# Altium schematic sheet config-top.SchDoc: Config FPGA - Top
size Legal; CheckedBy: J. Brinton; CompanyName: Signal Laboratories, Inc.; DrawnBy: J. Brinton; Engineer: J. Brinton; Address1: 3479 Edison Way; Address2: Menlo Park CA 94025; Address3: +1 (877) 778-8435; Address4: siglabs.com; DocumentNumber: 11; Revision: 2b; SheetNumber: 12; SheetTotal: 58
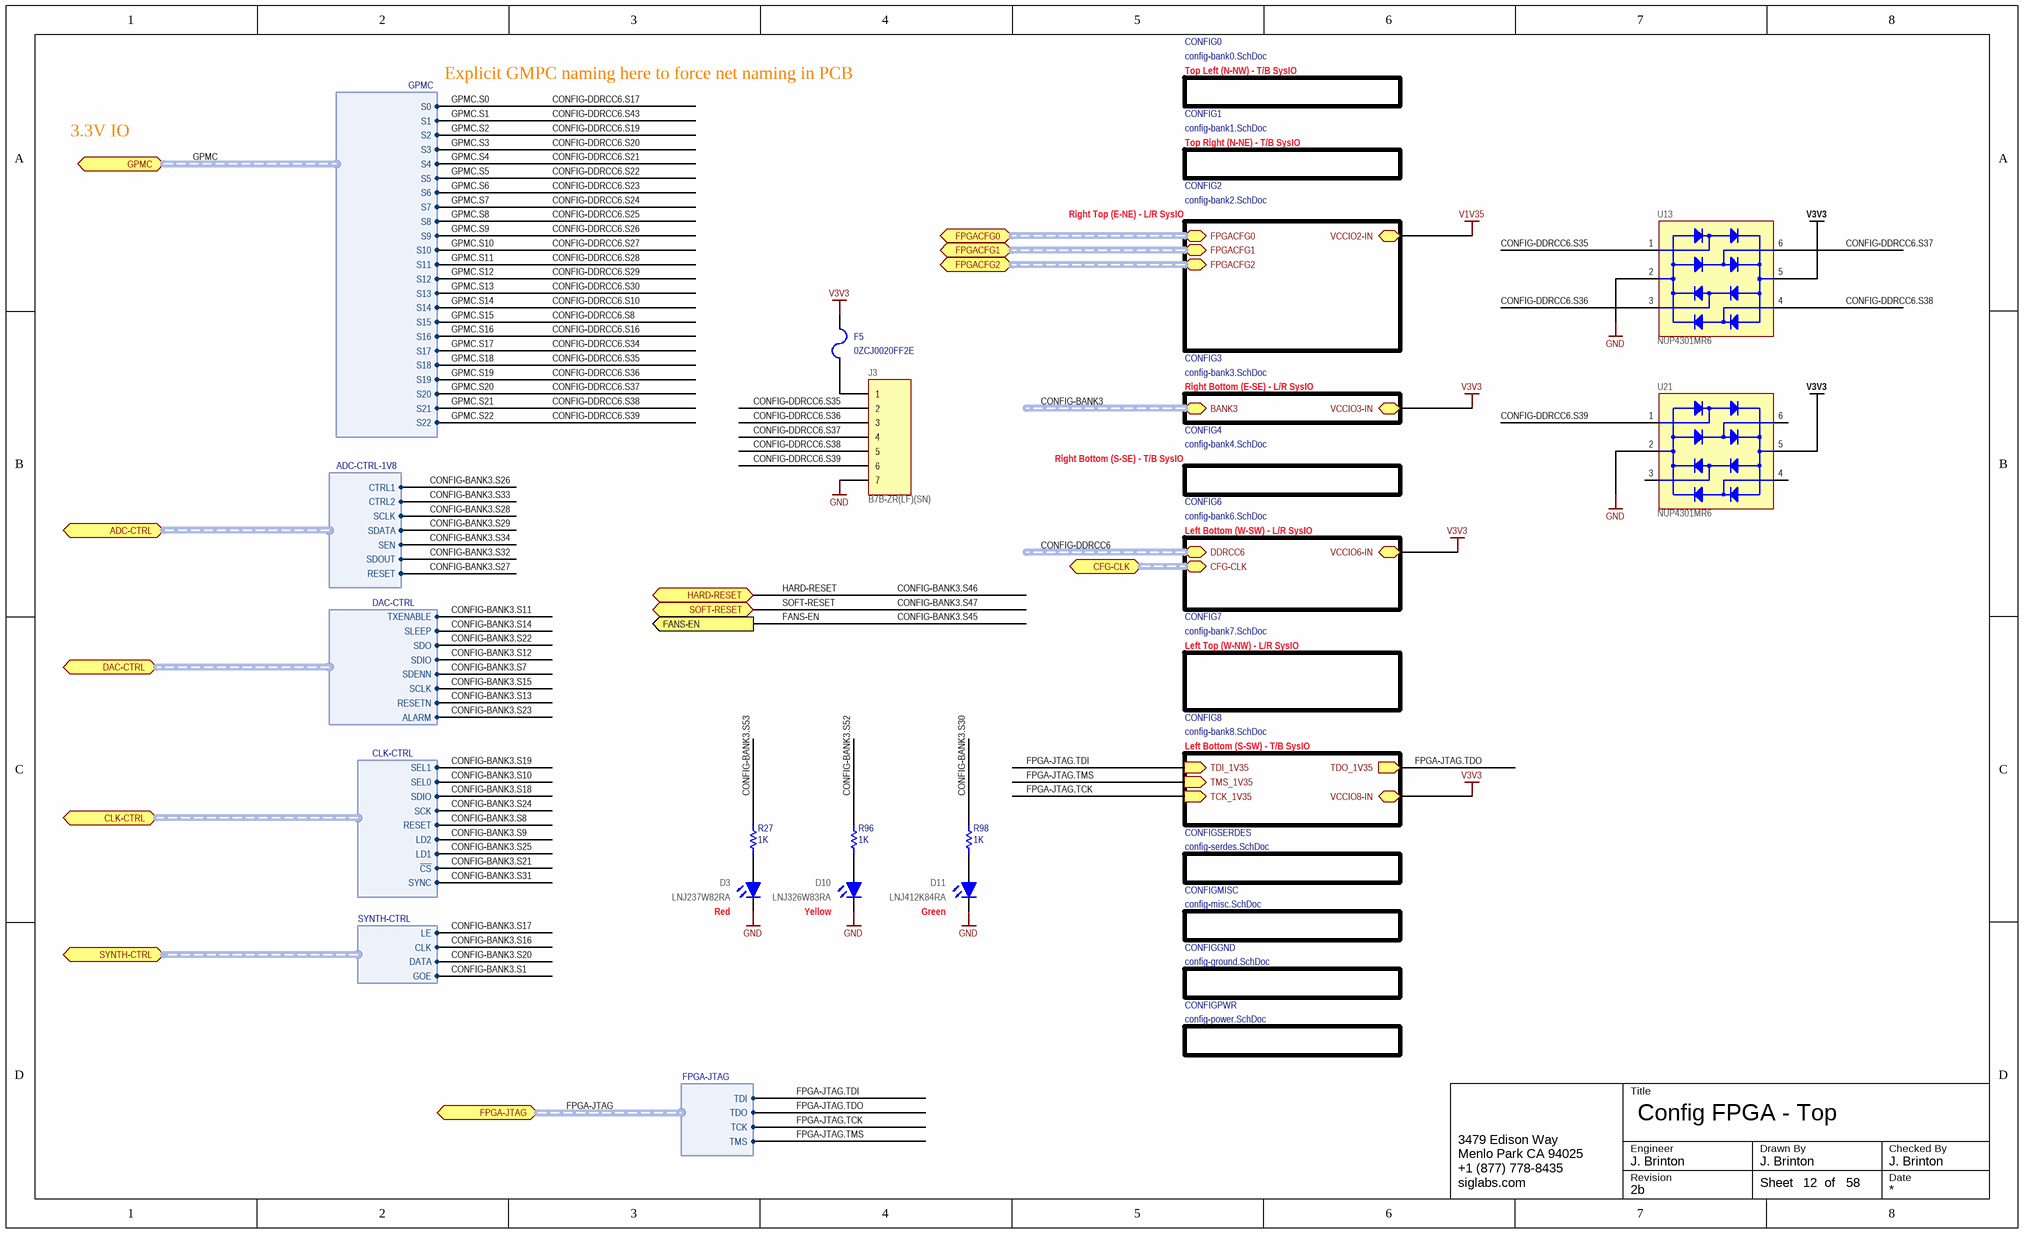
[diagram p0: config-top.SchDoc]

## Parts
D3  LNJ237W82RA  [0603_LED]
D10  LNJ326W83RA  [0603_LED]
D11  LNJ412K84RA  [0603_LED]
F5  0ZCJ0020FF2E  [1206]
J3  B7B-ZR(LF)(SN)  [B7B-ZR]
R27  value 1K  [0402]  (hidden comment: RC0402FR-071KL)
R96  value 1K  [0402]  (hidden comment: RC0402FR-071KL)
R98  value 1K  [0402]  (hidden comment: RC0402FR-071KL)
U13  NUP4301MR6  [SOT23-6]
U21  NUP4301MR6  [SOT23-6]

## Sub-sheets
CONFIG0 = config-bank0.SchDoc: no entries
CONFIG1 = config-bank1.SchDoc: no entries
CONFIG2 = config-bank2.SchDoc: FPGACFG0 (harness CONF_1V5), FPGACFG1 (harness CONF_1V5), FPGACFG2 (harness CONF_1V5), VCCIO2-IN
CONFIG3 = config-bank3.SchDoc: BANK3 (harness BANK3), VCCIO3-IN
CONFIG4 = config-bank4.SchDoc: no entries
CONFIG6 = config-bank6.SchDoc: DDRCC6 (harness DDRCC), VCCIO6-IN, CFG-CLK (harness CLK-LVPECL33)
CONFIG7 = config-bank7.SchDoc: no entries
CONFIG8 = config-bank8.SchDoc: TDO_1V35 (out), TDI_1V35 (in), TMS_1V35 (in), TCK_1V35 (in), VCCIO8-IN
CONFIGGND = config-ground.SchDoc: no entries
CONFIGMISC = config-misc.SchDoc: no entries
CONFIGPWR = config-power.SchDoc: no entries
CONFIGSERDES = config-serdes.SchDoc: no entries

## Ports
ADC-CTRL (harness ADC-CTRL-1V8), CFG-CLK (harness CLK-LVPECL33), CLK-CTRL (harness CLK-CTRL), DAC-CTRL (harness DAC-CTRL), FANS-EN (out), FPGA-JTAG (harness FPGA-JTAG), FPGACFG0 (harness CONF_1V5), FPGACFG1 (harness CONF_1V5), FPGACFG2 (harness CONF_1V5), GPMC (harness GPMC), HARD-RESET, SOFT-RESET, SYNTH-CTRL (harness SYNTH-CTRL)

## Harnesses
FPGA-JTAG: TDI, TDO, TCK, TMS
GPMC: S0, S1, S2, S3, S4, S5, S6, S7, S8, S9, S10, S11, S12, S13, S14, S15, S16, S17, S18, S19, S20, S21, S22
DAC-CTRL: ALARM, RESETN, SCLK, SDENN, SDIO, SDO, SLEEP, TXENABLE
CLK-CTRL: ~{CS}, LD1, LD2, RESET, SCK, SDIO, SEL0, SEL1, SYNC
ADC-CTRL-1V8: CTRL1, CTRL2, SCLK, SDATA, SEN, SDOUT, RESET
SYNTH-CTRL: GOE, CLK, DATA, LE

## Nets
GND: D3.2(K) D10.2(K) D11.2(K) J3.7 U13.2(VN) U21.2(VN)
V1V35: sheet CONFIG2/VCCIO2-IN
V3V3: F5.2 U13.5(VP) U21.5(VP) ; sheet CONFIG3/VCCIO3-IN, sheet CONFIG6/VCCIO6-IN, sheet CONFIG8/VCCIO8-IN
CONFIG-BANK3.S1: port SYNTH-CTRL.GOE
CONFIG-BANK3.S7: port DAC-CTRL.SDENN
CONFIG-BANK3.S8: port CLK-CTRL.RESET
CONFIG-BANK3.S9: port CLK-CTRL.LD2
CONFIG-BANK3.S10: port CLK-CTRL.SEL0
CONFIG-BANK3.S11: port DAC-CTRL.TXENABLE
CONFIG-BANK3.S12: port DAC-CTRL.SDIO
CONFIG-BANK3.S13: port DAC-CTRL.RESETN
CONFIG-BANK3.S14: port DAC-CTRL.SLEEP
CONFIG-BANK3.S15: port DAC-CTRL.SCLK
CONFIG-BANK3.S16: port SYNTH-CTRL.CLK
CONFIG-BANK3.S17: port SYNTH-CTRL.LE
CONFIG-BANK3.S18: port CLK-CTRL.SDIO
CONFIG-BANK3.S19: port CLK-CTRL.SEL1
CONFIG-BANK3.S20: port SYNTH-CTRL.DATA
CONFIG-BANK3.S21: port CLK-CTRL.~{CS}
CONFIG-BANK3.S22: port DAC-CTRL.SDO
CONFIG-BANK3.S23: port DAC-CTRL.ALARM
CONFIG-BANK3.S24: port CLK-CTRL.SCK
CONFIG-BANK3.S25: port CLK-CTRL.LD1
CONFIG-BANK3.S26: port ADC-CTRL.CTRL1
CONFIG-BANK3.S27: port ADC-CTRL.RESET
CONFIG-BANK3.S28: port ADC-CTRL.SCLK
CONFIG-BANK3.S29: port ADC-CTRL.SDATA
CONFIG-BANK3.S30: R98.2
CONFIG-BANK3.S31: port CLK-CTRL.SYNC
CONFIG-BANK3.S32: port ADC-CTRL.SDOUT
CONFIG-BANK3.S33: port ADC-CTRL.CTRL2
CONFIG-BANK3.S34: port ADC-CTRL.SEN
CONFIG-BANK3.S45: port FANS-EN  [also labelled FANS-EN]
CONFIG-BANK3.S46: port HARD-RESET  [also labelled HARD-RESET]
CONFIG-BANK3.S47: port SOFT-RESET  [also labelled SOFT-RESET]
CONFIG-BANK3.S52: R96.2
CONFIG-BANK3.S53: R27.2
CONFIG-DDRCC6.S8: port GPMC.S15  [also labelled GPMC.S15]
CONFIG-DDRCC6.S10: port GPMC.S14  [also labelled GPMC.S14]
CONFIG-DDRCC6.S16: port GPMC.S16  [also labelled GPMC.S16]
CONFIG-DDRCC6.S17: port GPMC.S0  [also labelled GPMC.S0]
CONFIG-DDRCC6.S19: port GPMC.S2  [also labelled GPMC.S2]
CONFIG-DDRCC6.S20: port GPMC.S3  [also labelled GPMC.S3]
CONFIG-DDRCC6.S21: port GPMC.S4  [also labelled GPMC.S4]
CONFIG-DDRCC6.S22: port GPMC.S5  [also labelled GPMC.S5]
CONFIG-DDRCC6.S23: port GPMC.S6  [also labelled GPMC.S6]
CONFIG-DDRCC6.S24: port GPMC.S7  [also labelled GPMC.S7]
CONFIG-DDRCC6.S25: port GPMC.S8  [also labelled GPMC.S8]
CONFIG-DDRCC6.S26: port GPMC.S9  [also labelled GPMC.S9]
CONFIG-DDRCC6.S27: port GPMC.S10  [also labelled GPMC.S10]
CONFIG-DDRCC6.S28: port GPMC.S11  [also labelled GPMC.S11]
CONFIG-DDRCC6.S29: port GPMC.S12  [also labelled GPMC.S12]
CONFIG-DDRCC6.S30: port GPMC.S13  [also labelled GPMC.S13]
CONFIG-DDRCC6.S34: port GPMC.S17  [also labelled GPMC.S17]
CONFIG-DDRCC6.S35: J3.2 U13.1(A) ; port GPMC.S18  [also labelled GPMC.S18]
CONFIG-DDRCC6.S36: J3.3 U13.3(B) ; port GPMC.S19  [also labelled GPMC.S19]
CONFIG-DDRCC6.S37: J3.4 U13.6(D) ; port GPMC.S20  [also labelled GPMC.S20]
CONFIG-DDRCC6.S38: J3.5 U13.4(C) ; port GPMC.S21  [also labelled GPMC.S21]
CONFIG-DDRCC6.S39: J3.6 U21.1(A) ; port GPMC.S22  [also labelled GPMC.S22]
CONFIG-DDRCC6.S43: port GPMC.S1  [also labelled GPMC.S1]
FPGA-JTAG.TCK: sheet CONFIG8/TCK_1V35, port FPGA-JTAG.TCK
FPGA-JTAG.TDI: sheet CONFIG8/TDI_1V35, port FPGA-JTAG.TDI
FPGA-JTAG.TDO: sheet CONFIG8/TDO_1V35, port FPGA-JTAG.TDO
FPGA-JTAG.TMS: sheet CONFIG8/TMS_1V35, port FPGA-JTAG.TMS
NetD3_1: D3.1(A) R27.1
NetD10_1: D10.1(A) R96.1
NetD11_1: D11.1(A) R98.1
NetF5_1: F5.1 J3.1

Not connected (* = marked no-connect by the designer): U21 3(B) 4(C) 6(D)

## Buses and harness runs
harness CONFIG-BANK3 = sheet CONFIG3/BANK3
harness CONFIG-DDRCC6 = sheet CONFIG6/DDRCC6
harness FPGA-JTAG = port FPGA-JTAG
harness GPMC = port GPMC
harness port CFG-CLK = sheet CONFIG6/CFG-CLK
harness port FPGACFG0 = sheet CONFIG2/FPGACFG0
harness port FPGACFG1 = sheet CONFIG2/FPGACFG1
harness port FPGACFG2 = sheet CONFIG2/FPGACFG2

## Notes on the sheet
- Explicit GMPC naming here to force net naming in PCB
- Top Left (N-NW) - T/B SysIO
- 3.3V IO
- Top Right (N-NE) - T/B SysIO
- Right Top (E-NE) - L/R SysIO
- Right Bottom (E-SE) - L/R SysIO
- Right Bottom (S-SE) - T/B SysIO
- Left Bottom (W-SW) - L/R SysIO
- Left Top (W-NW) - L/R SysIO
- Left Bottom (S-SW) - T/B SysIO
- (near D3) Red
- (near D10) Yellow
- (near D11) Green
- Title
- Engineer
- Revision
- Drawn By
- Checked By
- Date
- Sheet
- of

## Library data of the parts
D3 = LED0603RD: LED, SMT 0603, Color Red, 5mA, 1.85V; Manufacturer: Panasonic; Manufacturer P/N: LNJ237W82RA; Package: 0603 Polarized
D10 = LED0603GR: LED, SMT 0603, Color Green, 10mA, 2.05V; Manufacturer: Panasonic; Manufacturer P/N: LNJ326W83RA; Package: 0603 Polarized
D11 = LED0603Y: LED, SMT 0603, Color Yellow, 10mA, 2.05V; Manufacturer: Panasonic; Manufacturer P/N: LNJ412K84RA; Package: 0603 Polarized
F5 = 0ZCJ0020FF2E: PTC Resettable Fuse, 0.2A, 30V, SMD 1206; Manufacturer: Bell Fuse; Manufacturer P/N: 0ZCJ0020FF2E; Package: 1206
J3 = B7B-ZR(LF)(SN): Through-hole Shrouded Header 7-Position; Manufacturer: JST; Manufacturer P/N: B7B-ZR(LF)(SN)
R27 R96 R98 = RES 0402: Thick Film Resistor 1k ±1% 0402; Manufacturer: Yageo; Tr: -55:155; Package: 0402; Manufacturer P/N: RC0402FR-071KL; Do Not Place: *; Tolerance: ±1%
U13 U21 = NUP4301MR6: 4-Lane TVS Diode Array; Manufacturer: On Semiconductor; Manufacturer P/N: NUP4301MR6